# EAGLE schematic controller (EAGLE 6.5.0)
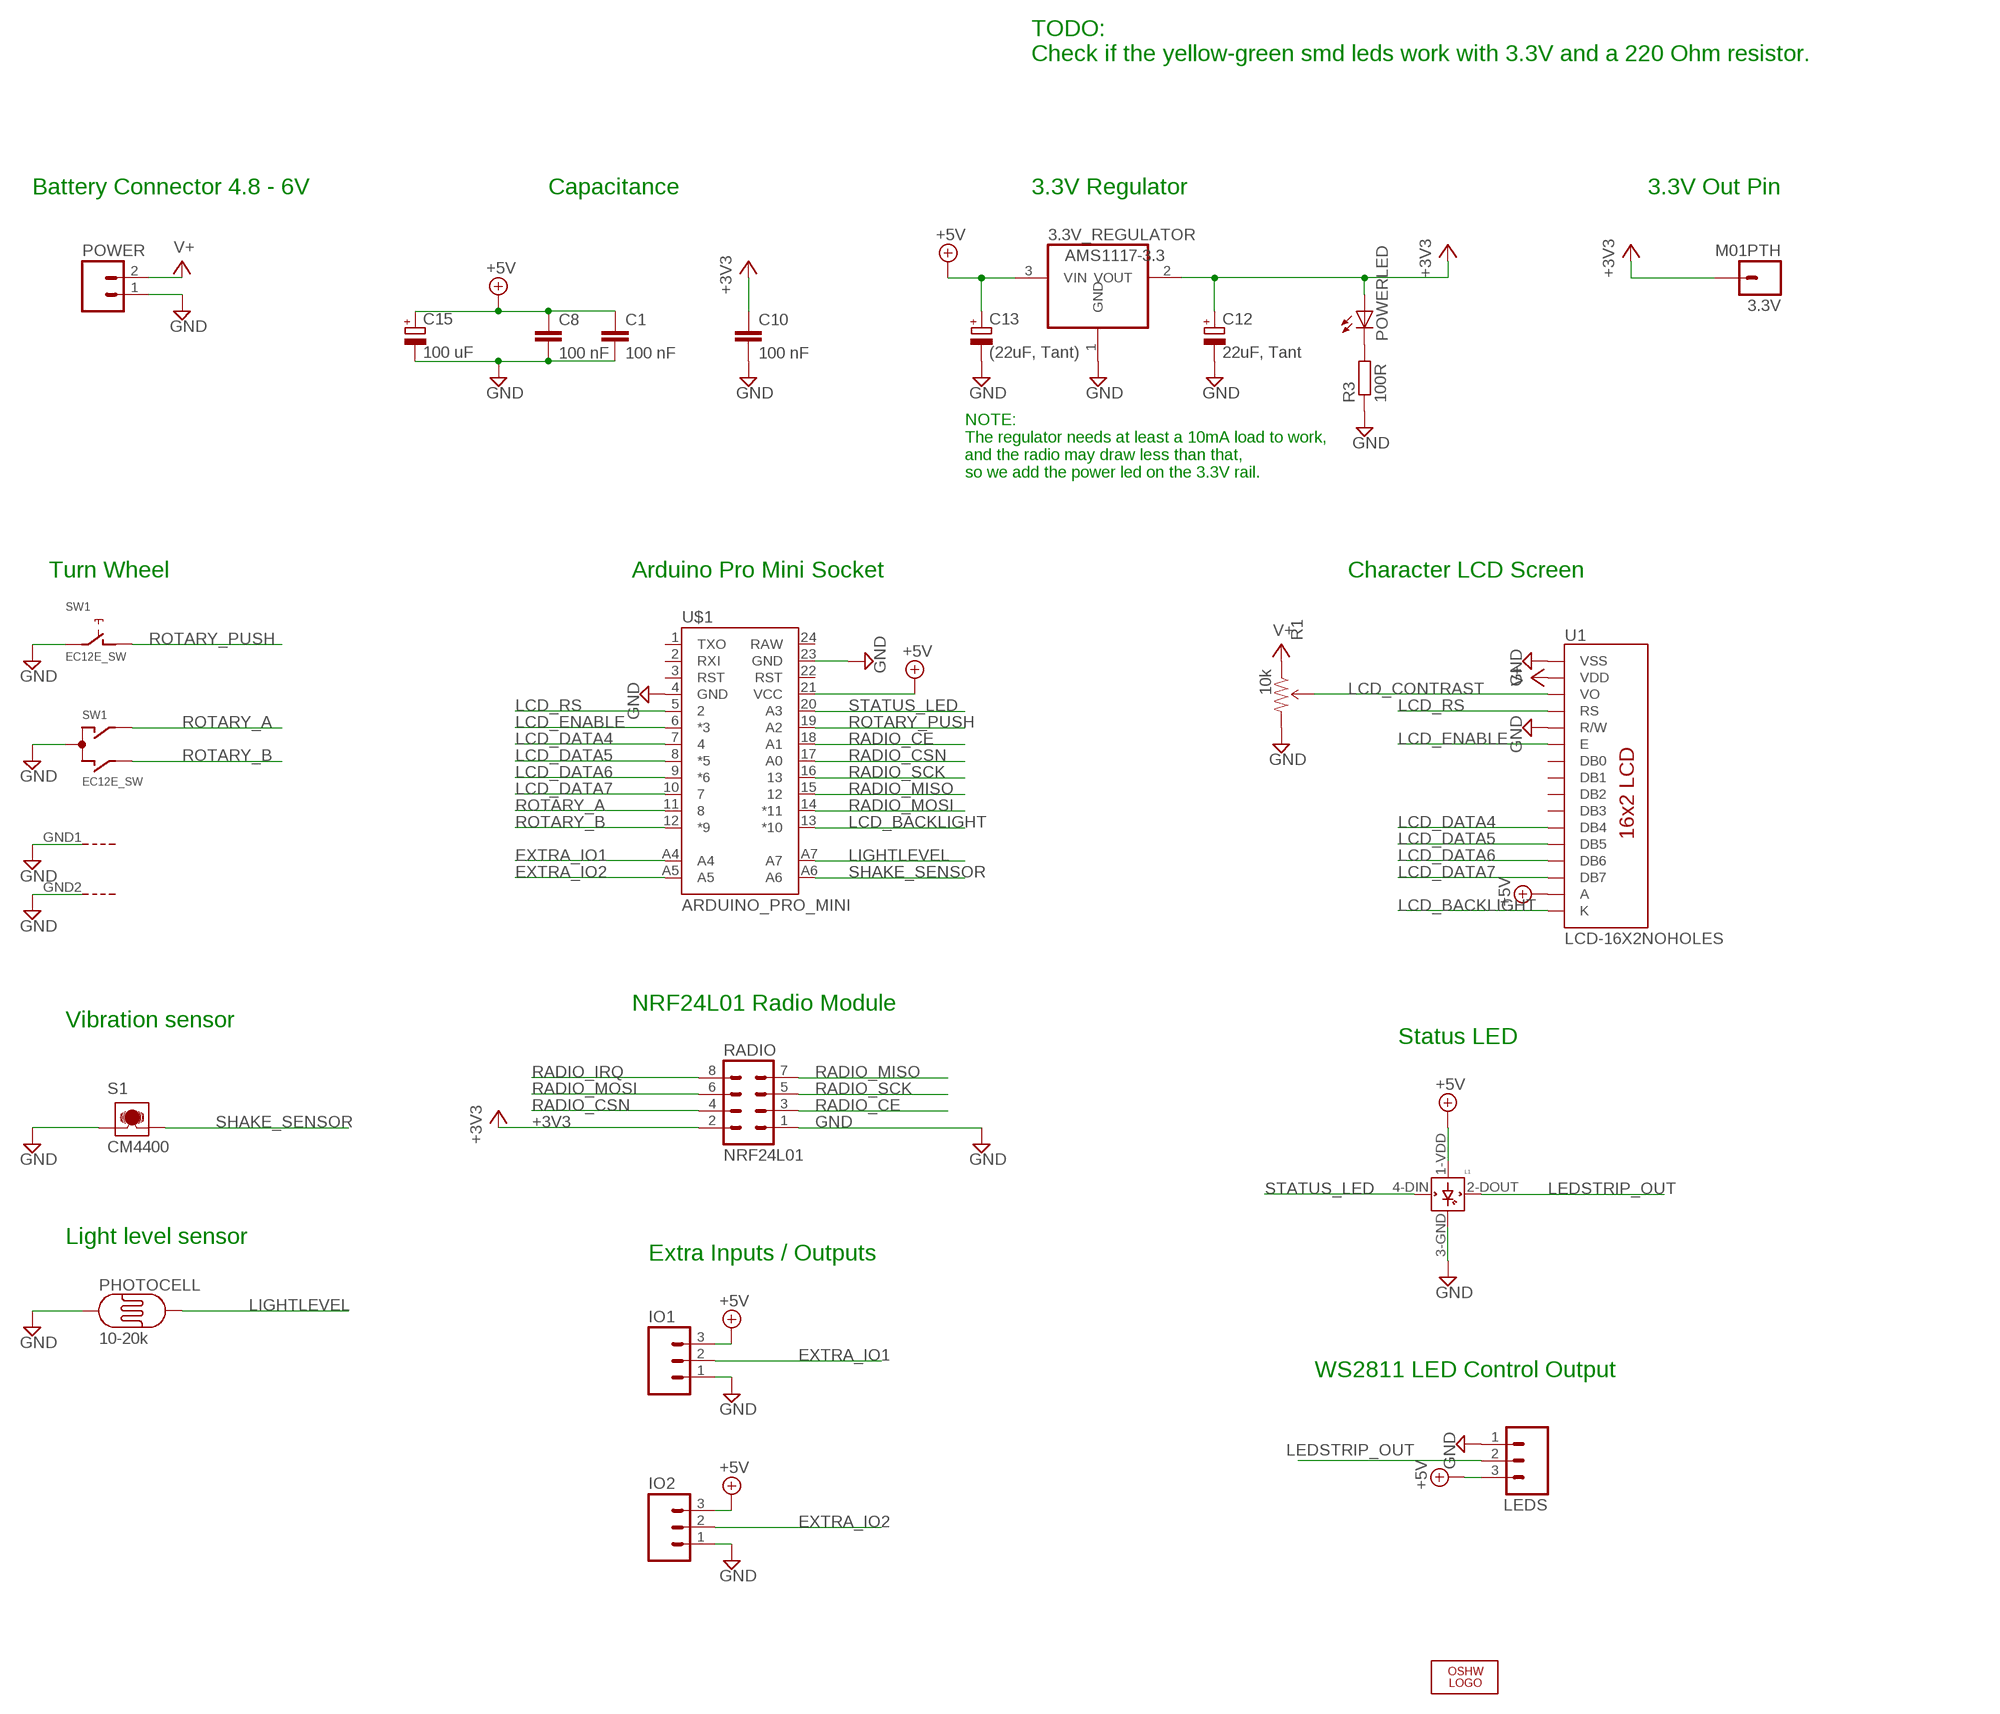
[diagram p0: schematic, sheet 1]

## Parts
3.3V  M01PTH  [1X01]
3.3V_REGULATOR  AMS1117-3.3  REG1117  [SOT223]
C1  100 nF  C-EUC0805  [C0805]
C8  100 nF  C-EUC0805  [C0805]
C10  100 nF  C-EUC0805  [C0805]
C12  22uF, Tant  CPOL-EUSMCA  [SMC_A]
C13  (22uF, Tant)  CPOL-EUSMCA  [SMC_A]
C15  100 uF  CPOL-EUE2.5-6  [E2,5-6]
IO1  M03PTH  [1X03]
IO2  M03PTH  [1X03]
L1  WS2812B  [WS2812B]
LEDS  M03PTH  [1X03]
LOGO3  LOGO-OSHW-8MILX0100-NT  [OSHW_8X100_NOTEXT]
PHOTOCELL  10-20k  PHOTOCELLPTH  [PHOTOCELL]
POWER  M02LOCK_LONGPADS  [1X02_LOCK_LONGPADS]
POWERLED  LEDSMT1206  [1206]
R1  10k  TRIMPOT  [3362U-2]
R3  100R  R-EU_M0805  [M0805]
RADIO  NRF24L01  MA04-2  [MA04-2]
S1  CM4400  [CM4400]
SW1  EC12E_SW  [ALPS_EC12E_SW]
U1  LCD-16X2NOHOLES  [LCD-16X2_NOHOLES]
U$1  ARDUINO_PRO_MINI  [ARDUINO_PRO_MINI]

## Nets
+3V3: 3.3V.1 3.3V_REGULATOR.2(VOUT) C10.1 C12.+ POWERLED.A RADIO.2
+5V: 3.3V_REGULATOR.3(VIN) C1.1 C8.1 C13.+ C15.+ IO1.3 IO2.3 L1.1-VDD(VDD) LEDS.3 U1.15(A) U$1.21(VCC)
EXTRA_IO1: IO1.2 U$1.A4
EXTRA_IO2: IO2.2 U$1.A5
GND: 3.3V_REGULATOR.1(GND) C1.2 C8.2 C10.2 C12.- C13.- C15.- IO1.1 IO2.1 L1.3-GND(GND) LEDS.1 PHOTOCELL.1 POWER.1 R1.3(CW) R3.1 RADIO.1 S1.1 SW1.C SW1.E SW1.GND1(G) SW1.GND2(G) U1.1(VSS) U1.5(R/W) U$1.4(GND) U$1.23(GND)
LCD_BACKLIGHT: U1.16(K) U$1.13(*10)
LCD_CONTRAST: R1.2(WIPER) U1.3(VO)
LCD_DATA4: U1.11(DB4) U$1.7
LCD_DATA5: U1.12(DB5) U$1.8(*5)
LCD_DATA6: U1.13(DB6) U$1.9(*6)
LCD_DATA7: U1.14(DB7) U$1.10
LCD_ENABLE: U1.6(E) U$1.6(*3)
LCD_RS: U1.4(RS) U$1.5
LEDSTRIP_OUT: L1.2-DOUT(DOUT) LEDS.2
LIGHTLEVEL: PHOTOCELL.2 U$1.A7
N$1: POWERLED.C R3.2
RADIO_CE: RADIO.3 U$1.18(A1)
RADIO_CSN: RADIO.4 U$1.17(A0)
RADIO_IRQ: RADIO.8
RADIO_MISO: RADIO.7 U$1.15
RADIO_MOSI: RADIO.6 U$1.14(*11)
RADIO_SCK: RADIO.5 U$1.16
ROTARY_A: SW1.A U$1.11
ROTARY_B: SW1.B U$1.12(*9)
ROTARY_PUSH: SW1.D U$1.19(A2)
SHAKE_SENSOR: S1.2 U$1.A6
STATUS_LED: L1.4-DIN(DIN) U$1.20(A3)
V+: POWER.2 R1.1(CCW) U1.2(VDD)
Unconnected: U1.7(DB0) U1.8(DB1) U1.9(DB2) U1.10(DB3) U$1.1(TXO) U$1.2(RXI) U$1.3(RST) U$1.22(RST) U$1.24(RAW)

## Notes on the sheet
- TODO:
  Check if the yellow-green smd leds work with 3.3V and a 220 Ohm resistor.
- Battery Connector 4.8 - 6V | Capacitance | 3.3V Regulator | 3.3V Out Pin
- NOTE:
  The regulator needs at least a 10mA load to work, 
  and the radio may draw less than that, 
  so we add the power led on the 3.3V rail.
- Turn Wheel | Arduino Pro Mini Socket | Character LCD Screen
- NRF24L01 Radio Module
- Vibration sensor
- Status LED
- Light level sensor
- Extra Inputs / Outputs
- WS2811 LED Control Output

## Library data of the parts
3.3V = SparkFun-Connectors:M01: Header 1 Standard 1-pin 0.1" header. Use with straight break away headers (SKU : PRT-00116), right angle break away headers (PRT-00553), swiss pins (PRT-00743), machine pins (PRT-00117), and female headers (PRT-00115).
3.3V_REGULATOR = burr-brown:REG1117: 800mA and 1A Low Dropout (LDO) Positive Regulator 1.8V, 2.5V, 2.85V, 3.3V, 5V, and Adj; MPN: REG1117; OC_FARNELL: 1097566; OC_NEWARK: 14P6981
C1 C8 C10 = rcl:C-EU: CAPACITOR, European symbol
C12 C13 C15 = rcl:CPOL-EU: POLARIZED CAPACITOR, European symbol
IO1 IO2 LEDS = SparkFun-Connectors:M03: Header 3 Standard 3-pin 0.1" header. Use with straight break away headers (SKU : PRT-00116), right angle break away headers (PRT-00553), swiss pins (PRT-00743), machine pins (PRT-00117), and female headers (PRT-00115). Molex polarized connector foot print use with SKU : PRT-08232 with associated crimp pins and housings.
L1 = adafruit:WS2812B
LOGO3 = Logo:LOGO-OSHW-8MIL
PHOTOCELL = SparkFun-Sensors:PHOTOCELL: CdS photoresistor. This is a low cost way to detect light levels. Resistance decreases with more incoming light. SparkFun SKU: SEN-09088
POWER = SparkFun:M02: Header 2 Standard 2-pin 0.1" header. Use with straight break away headers (SKU : PRT-00116), right angle break away headers (PRT-00553), swiss pins (PRT-00743), machine pins (PRT-00117), and female headers (PRT-00115). Molex polarized connector foot print use with SKU : PRT-08233 with associated crimp pins and housings.
POWERLED = led:LED: LED OSRAM: - CHIPLED LG R971, LG N971, LY N971, LG Q971, LY Q971, LO R971, LY R971 LH N974, LH R974 LS Q976, LO Q976, LY Q976 LO Q996 - Hyper CHIPLED LW Q18S LB Q993, LB Q99A, LB R99A - SideLED LS A670, LO A670, LY A670, LG A670, LP A670 LB A673, LV A673, LT A673, LW A673 LH A674 LY A675 LS A676, LA A676, LO A676, LY A676, LW A676 LS A679, LY A679, LG A679 - Hyper Micro SIDELED® LS Y876, LA Y876, LO Y876, LY Y876 LT Y87S - SmartLED LW L88C, LW L88S LB L89C, LB L89S, LG L890 LS L89K, LO L89K, LY L89K LS L896, LA L896, LO L896, LY L896 - TOPLED LS T670, LO T670, LY T670, LG T670, LP T670 LSG T670, LSP T670, LSY T670, LOP T670, LYG T670 LG T671, LOG T671, LSG T671 LB T673, LV T673, LT T673, LW T673 LH T674 LS T676, LA T676, LO T676, LY T676, LB T676, LH T676, LSB T676, LW T676 LB T67C, LV T67C, LT T67C, LS T67K, LO T67K, LY T67K, LW E67C LS E67B, LA E67B, LO E67B, LY E67B, LB E67C, LV E67C, LT E67C LW T67C LS T679, LY T679, LG T679 LS T770, LO T770, LY T770, LG T770, LP T770 LB T773, LV T773, LT T773, LW T773 LH T774 LS E675, LA E675, LY E675, LS T675 LS T776, LA T776, LO T776, LY T776, LB T776 LHGB T686 LT T68C, LB T68C - Hyper Mini TOPLED® LB M676 - Mini TOPLED Santana® LG M470 LS M47K, LO M47K, LY M47K Source: http://www.osram.convergy.de LUXEON: - LUMILED® LXK2-PW12-R00, LXK2-PW12-S00, LXK2-PW14-U00, LXK2-PW14-V00 LXK2-PM12-R00, LXK2-PM12-S00, LXK2-PM14-U00 LXK2-PE12-Q00, LXK2-PE12-R00, LXK2-PE12-S00, LXK2-PE14-T00, LXK2-PE14-U00 LXK2-PB12-K00, LXK2-PB12-L00, LXK2-PB12-M00, LXK2-PB14-N00, LXK2-PB14-P00, LXK2-PB14-Q00 LXK2-PR12-L00, LXK2-PR12-M00, LXK2-PR14-Q00, LXK2-PR14-R00 LXK2-PD12-Q00, LXK2-PD12-R00, LXK2-PD12-S00 LXK2-PH12-R00, LXK2-PH12-S00 LXK2-PL12-P00, LXK2-PL12-Q00, LXK2-PL12-R00 Source: www.luxeon.com KINGBRIGHT: KA-3528ASYC Source: www.kingbright.com
R1 = SparkFun:TRIMPOT
R3 = rcl:R-EU_: RESISTOR, European symbol
RADIO = con-lstb:MA04-2: PIN HEADER; OC_FARNELL: unknown; OC_NEWARK: unknown
S1 = sensor-comus-group:CM4400: MOVEMENT / VIBRATION SWITCH - Mercury Contacts Source: Assemtech Europe Limited, E. Bachem GmbH Comus International, W. Gunther GmbH, Gunther Belgium; MF: FARNELL; MPN: CM4400-1.; OC_FARNELL: 540626; OC_NEWARK: 09WX7014
SW1 = switch-alps:EC12E_SW: ALPS rotary Encoder EC12E series with switch; MPN: EC12E2424407; OC_FARNELL: 1520813; OC_NEWARK: 74M1068
U1 = SparkFun:LCD-16X2
U$1 = SparkFun-Boards-with-arduino-pro-mini-without-connection-pins:ARDUINO_PRO_MINI